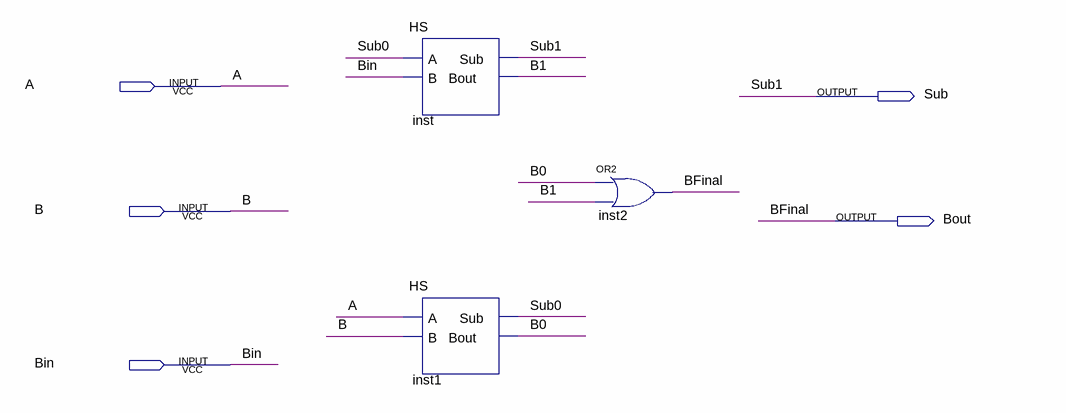
[diagram p0: schematic sheet]
// Quartus schematic FS.bdf as structural Verilog: 3 symbols, 5 pins
module FS (
  input  A,
  input  B,
  input  Bin,
  output Sub,
  output Bout
);

  wire B0, B1, Sub0;

  HS inst (.A(Sub0), .B(Bin), .Sub(Sub), .Bout(B1));
  HS inst1 (.A(A), .B(B), .Sub(Sub0), .Bout(B0));
  or inst2 (Bout, B0, B1);

  // Other names for the same wires on the sheet: BFinal = Bout; Sub1 = Sub
endmodule
